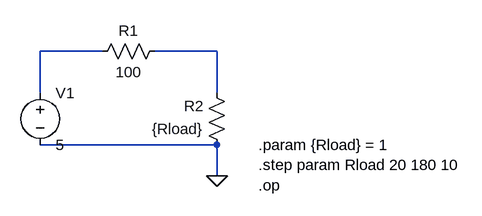
[diagram p0: schematic Part 1- DC analysis b.asc]
Part 1- DC analysis b.asc, the LTspice schematic file:
Version 4
SHEET 1 960 680
WIRE 384 144 288 144
WIRE 560 144 464 144
WIRE 288 208 288 144
WIRE 560 208 560 144
WIRE 560 288 288 288
WIRE 560 336 560 288
FLAG 560 336 0
SYMBOL voltage 288 192 R0
SYMATTR InstName V1
SYMATTR Value 5
SYMBOL res 480 128 R90
WINDOW 0 0 56 VBottom 2
WINDOW 3 32 56 VTop 2
SYMATTR InstName R1
SYMATTR Value 100
SYMBOL res 576 304 R180
WINDOW 0 36 76 Left 2
WINDOW 3 36 40 Left 2
SYMATTR InstName R2
SYMATTR Value {Rload}
TEXT 624 288 Left 2 !.param {Rload} = 1\n.step param Rload 20 180 10\n.op

The netlist it stands for:
* Part 1- DC analysis b.asc
V1 N001 0 5
R1 N002 N001 100
R2 0 N002 {Rload}
.param {Rload} = 1
.step param Rload 20 180 10
.op
.backanno
.end